# Altium schematic sheet FPGA.SchDoc
size A3; DocumentNumber: 6; SheetNumber: 6; SheetTotal: 8
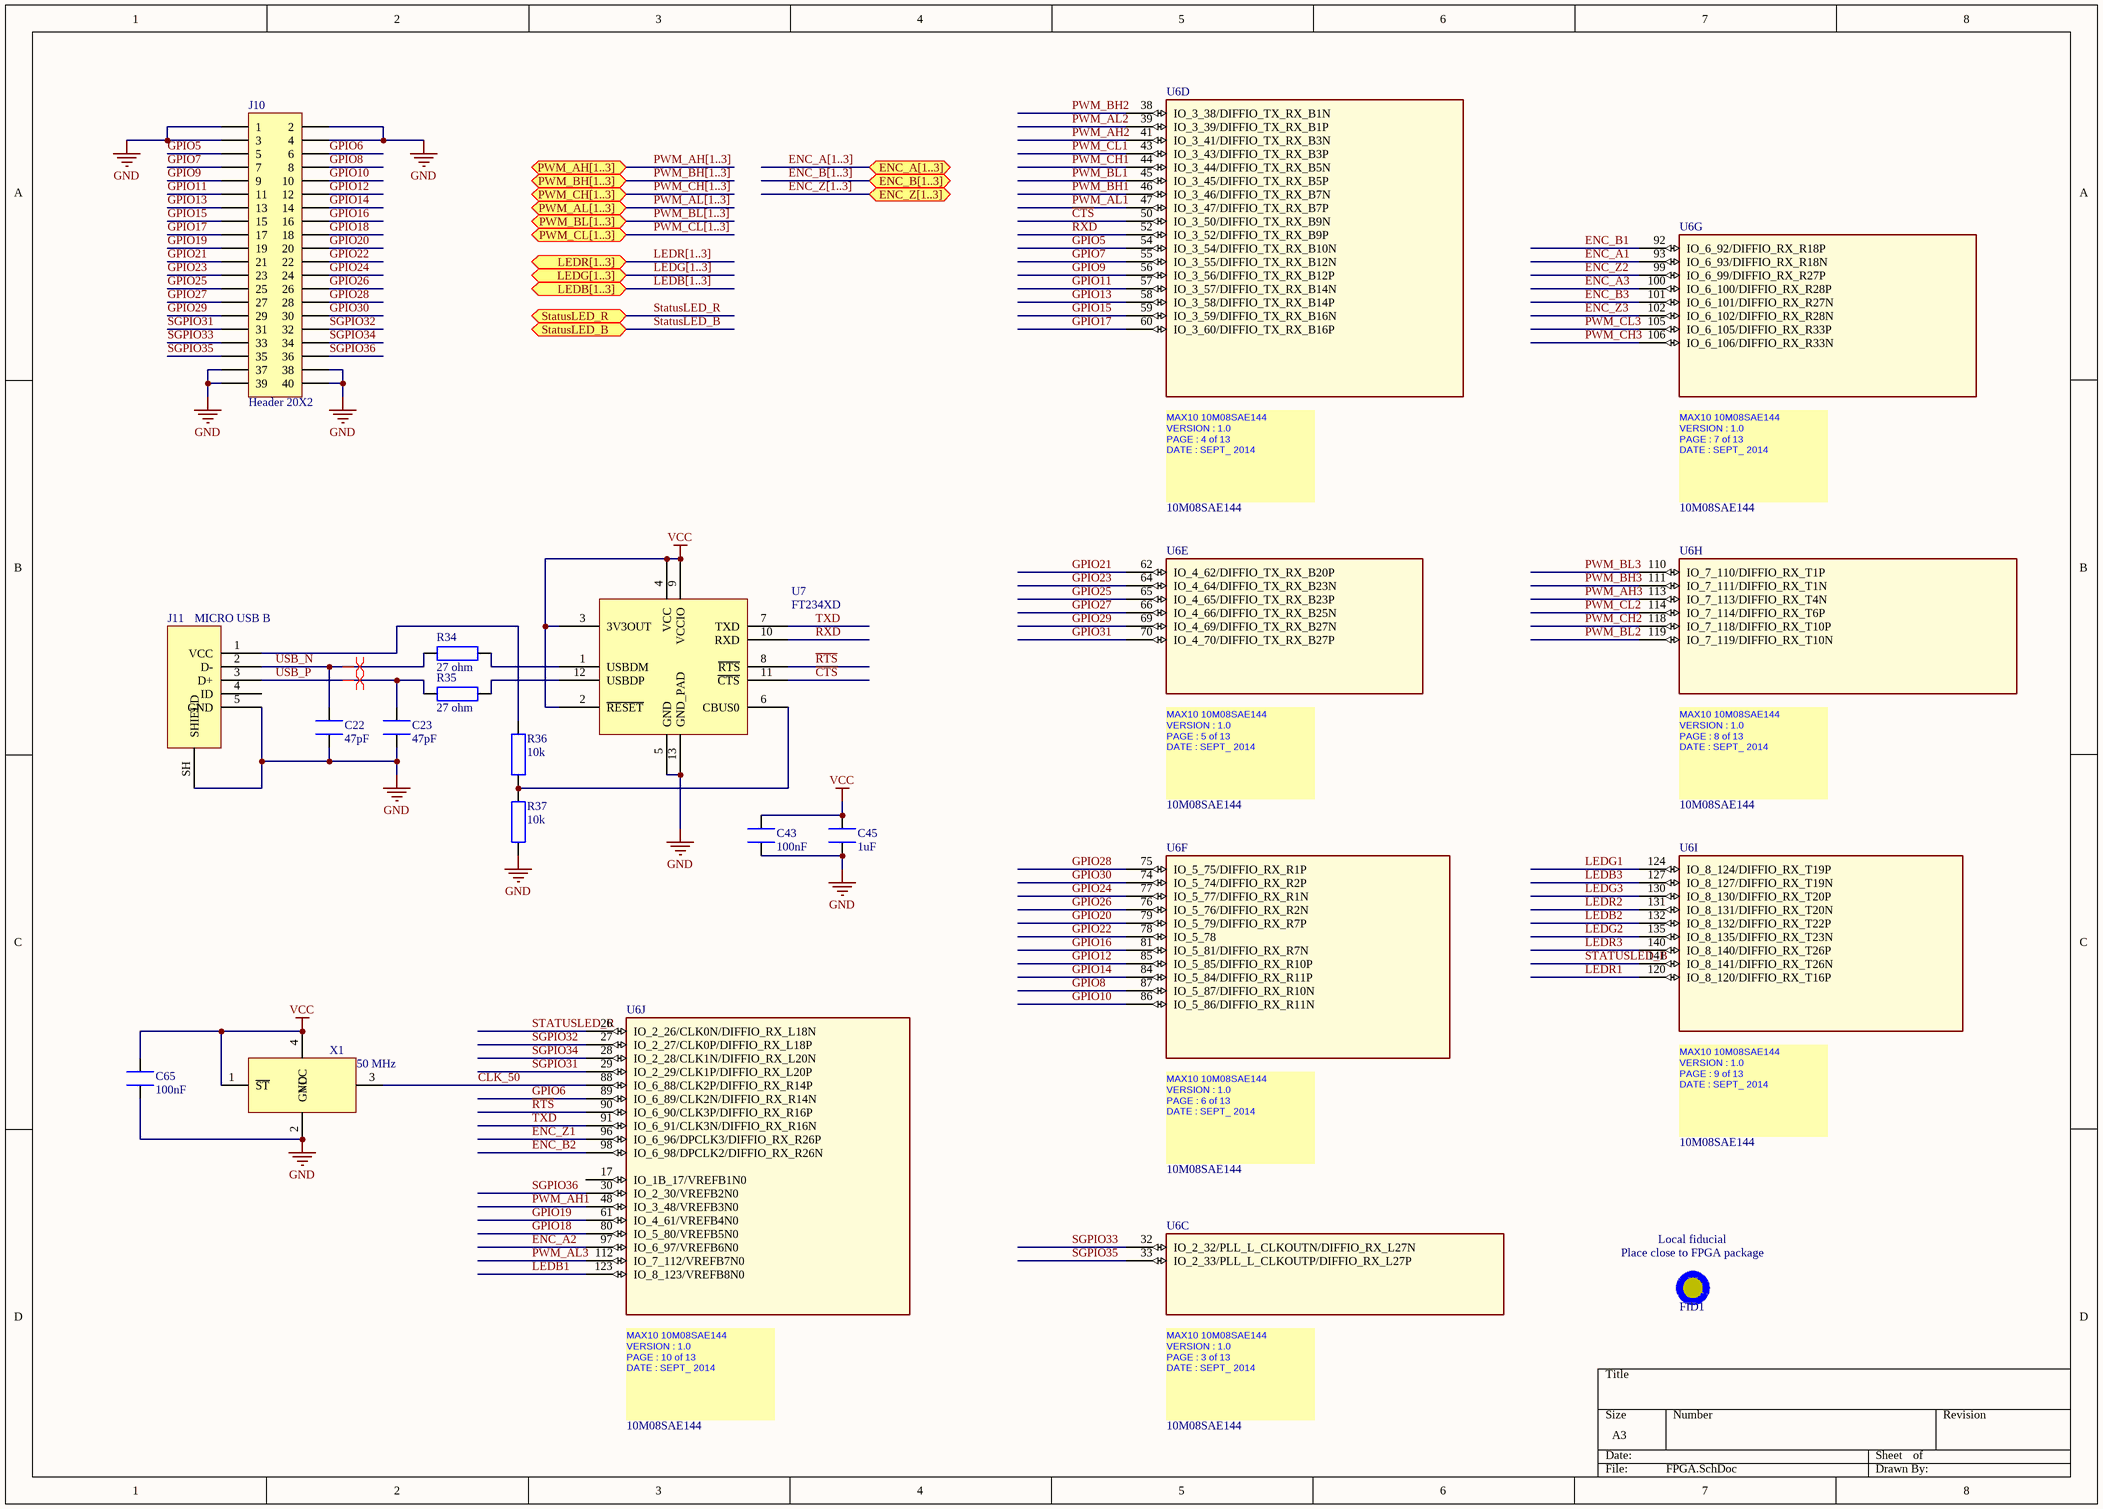
[diagram p0: FPGA.SchDoc]

## Parts
C22  value 47pF  [1608[0603]]  (hidden comment: MC0603N470J500CT)
C23  value 47pF  [1608[0603]]  (hidden comment: MC0603N470J500CT)
C43  value 100nF  [1608[0603]]  (hidden comment: MC0603B104K160CT)
C45  value 1uF  [1608[0603]]  (hidden comment: MC0603X105K160)
C65  value 100nF  [1608[0603]]  (hidden comment: MC0603B104K160CT)
FID1  FIDUCIAL  [FIDUCIAL]  (value not drawn)
J10  Header 20X2  [HDR2X20]
J11  MICRO USB B  [USB_0103594-0001LF]
R34  value 27 ohm  [RESC1608X55N]  (hidden comment: MCWR06X27R0FTL)
R35  value 27 ohm  [RESC1608X55N]  (hidden comment: MCWR06X27R0FTL)
R36  value 10k  [RESC1608X06L]  (hidden comment: MCMR06X1002FTL)
R37  value 10k  [RESC1608X06L]  (hidden comment: MCMR06X1002FTL)
U6  10M08SAE144  [SQFP50P2200X2200X165_HS-145N]  (parts C,D,E,F,G,H,I,J of 13)
U7  FT234XD  [SON45P300X90_HS-13N]
X1  value 50 MHz  [SPXO SG-210STF]  (hidden comment: X1G0041710047)

## Ports
ENC_A[1..3], ENC_B[1..3], ENC_Z[1..3], LEDB[1..3], LEDG[1..3], LEDR[1..3], PWM_AH[1..3], PWM_AL[1..3], PWM_BH[1..3], PWM_BL[1..3], PWM_CH[1..3], PWM_CL[1..3], StatusLED_B, StatusLED_R

## Nets
GND: C22.1 C23.1 C43.1 C45.1 C65.1 J10.1 J10.2 J10.3 J10.4 J10.37 J10.38 J10.39 J10.40 J11.5(GND) J11.SH(SHIELD) R37.1 U7.5(GND) U7.13(GND_PAD) X1.2(GND)
VCC: C43.2 C45.2 C65.2 U7.2(~{RESET}) U7.3(3V3OUT) U7.4(VCC) U7.9(VCCIO) X1.1(~{ST}) X1.4(VCC)
~{CTS}: U6.50(IO_3_50/DIFFIO_TX_RX_B9N) U7.11(~{CTS})
~{RTS}: U6.90(IO_6_90/CLK3P/DIFFIO_RX_R16P) U7.8(~{RTS})
CLK_50: U6.88(IO_6_88/CLK2P/DIFFIO_RX_R14P) X1.3(CLKout)
ENC_A1: U6.93(IO_6_93/DIFFIO_RX_R18N)
ENC_A2: U6.97(IO_6_97/VREFB6N0)
ENC_A3: U6.100(IO_6_100/DIFFIO_RX_R28P)
ENC_B1: U6.92(IO_6_92/DIFFIO_RX_R18P)
ENC_B2: U6.98(IO_6_98/DPCLK2/DIFFIO_RX_R26N)
ENC_B3: U6.101(IO_6_101/DIFFIO_RX_R27N)
ENC_Z1: U6.96(IO_6_96/DPCLK3/DIFFIO_RX_R26P)
ENC_Z2: U6.99(IO_6_99/DIFFIO_RX_R27P)
ENC_Z3: U6.102(IO_6_102/DIFFIO_RX_R28N)
GPIO5: J10.5 U6.54(IO_3_54/DIFFIO_TX_RX_B10N)
GPIO6: J10.6 U6.89(IO_6_89/CLK2N/DIFFIO_RX_R14N)
GPIO7: J10.7 U6.55(IO_3_55/DIFFIO_TX_RX_B12N)
GPIO8: J10.8 U6.87(IO_5_87/DIFFIO_RX_R10N)
GPIO9: J10.9 U6.56(IO_3_56/DIFFIO_TX_RX_B12P)
GPIO10: J10.10 U6.86(IO_5_86/DIFFIO_RX_R11N)
GPIO11: J10.11 U6.57(IO_3_57/DIFFIO_TX_RX_B14N)
GPIO12: J10.12 U6.85(IO_5_85/DIFFIO_RX_R10P)
GPIO13: J10.13 U6.58(IO_3_58/DIFFIO_TX_RX_B14P)
GPIO14: J10.14 U6.84(IO_5_84/DIFFIO_RX_R11P)
GPIO15: J10.15 U6.59(IO_3_59/DIFFIO_TX_RX_B16N)
GPIO16: J10.16 U6.81(IO_5_81/DIFFIO_RX_R7N)
GPIO17: J10.17 U6.60(IO_3_60/DIFFIO_TX_RX_B16P)
GPIO18: J10.18 U6.80(IO_5_80/VREFB5N0)
GPIO19: J10.19 U6.61(IO_4_61/VREFB4N0)
GPIO20: J10.20 U6.79(IO_5_79/DIFFIO_RX_R7P)
GPIO21: J10.21 U6.62(IO_4_62/DIFFIO_TX_RX_B20P)
GPIO22: J10.22 U6.78(IO_5_78)
GPIO23: J10.23 U6.64(IO_4_64/DIFFIO_TX_RX_B23N)
GPIO24: J10.24 U6.77(IO_5_77/DIFFIO_RX_R1N)
GPIO25: J10.25 U6.65(IO_4_65/DIFFIO_TX_RX_B23P)
GPIO26: J10.26 U6.76(IO_5_76/DIFFIO_RX_R2N)
GPIO27: J10.27 U6.66(IO_4_66/DIFFIO_TX_RX_B25N)
GPIO28: J10.28 U6.75(IO_5_75/DIFFIO_RX_R1P)
GPIO29: J10.29 U6.69(IO_4_69/DIFFIO_TX_RX_B27N)
GPIO30: J10.30 U6.74(IO_5_74/DIFFIO_RX_R2P)
GPIO31: U6.70(IO_4_70/DIFFIO_TX_RX_B27P)
LEDB1: U6.123(IO_8_123/VREFB8N0)
LEDB2: U6.132(IO_8_132/DIFFIO_RX_T22P)
LEDB3: U6.127(IO_8_127/DIFFIO_RX_T19N)
LEDG1: U6.124(IO_8_124/DIFFIO_RX_T19P)
LEDG2: U6.135(IO_8_135/DIFFIO_RX_T23N)
LEDG3: U6.130(IO_8_130/DIFFIO_RX_T20P)
LEDR1: U6.120(IO_8_120/DIFFIO_RX_T16P)
LEDR2: U6.131(IO_8_131/DIFFIO_RX_T20N)
LEDR3: U6.140(IO_8_140/DIFFIO_RX_T26P)
PWM_AH1: U6.48(IO_3_48/VREFB3N0)
PWM_AH2: U6.41(IO_3_41/DIFFIO_TX_RX_B3N)
PWM_AH3: U6.113(IO_7_113/DIFFIO_RX_T4N)
PWM_AL1: U6.47(IO_3_47/DIFFIO_TX_RX_B7P)
PWM_AL2: U6.39(IO_3_39/DIFFIO_TX_RX_B1P)
PWM_AL3: U6.112(IO_7_112/VREFB7N0)
PWM_BH1: U6.46(IO_3_46/DIFFIO_TX_RX_B7N)
PWM_BH2: U6.38(IO_3_38/DIFFIO_TX_RX_B1N)
PWM_BH3: U6.111(IO_7_111/DIFFIO_RX_T1N)
PWM_BL1: U6.45(IO_3_45/DIFFIO_TX_RX_B5P)
PWM_BL2: U6.119(IO_7_119/DIFFIO_RX_T10N)
PWM_BL3: U6.110(IO_7_110/DIFFIO_RX_T1P)
PWM_CH1: U6.44(IO_3_44/DIFFIO_TX_RX_B5N)
PWM_CH2: U6.118(IO_7_118/DIFFIO_RX_T10P)
PWM_CH3: U6.106(IO_6_106/DIFFIO_RX_R33N)
PWM_CL1: U6.43(IO_3_43/DIFFIO_TX_RX_B3P)
PWM_CL2: U6.114(IO_7_114/DIFFIO_RX_T6P)
PWM_CL3: U6.105(IO_6_105/DIFFIO_RX_R33P)
RXD: U6.52(IO_3_52/DIFFIO_TX_RX_B9P) U7.10(RXD)
SGPIO31: J10.31 U6.29(IO_2_29/CLK1P/DIFFIO_RX_L20P)
SGPIO32: J10.32 U6.27(IO_2_27/CLK0P/DIFFIO_RX_L18P)
SGPIO33: J10.33 U6.32(IO_2_32/PLL_L_CLKOUTN/DIFFIO_RX_L27N)
SGPIO34: J10.34 U6.28(IO_2_28/CLK1N/DIFFIO_RX_L20N)
SGPIO35: J10.35 U6.33(IO_2_33/PLL_L_CLKOUTP/DIFFIO_RX_L27P)
SGPIO36: J10.36 U6.30(IO_2_30/VREFB2N0)
StatusLED_B: U6.141(IO_8_141/DIFFIO_RX_T26N) ; port StatusLED_B
StatusLED_R: U6.26(IO_2_26/CLK0N/DIFFIO_RX_L18N) ; port StatusLED_R
TXD: U6.91(IO_6_91/CLK3N/DIFFIO_RX_R16N) U7.7(TXD)
USB_N: C22.2 J11.2(D-) R34.2
USB_P: C23.2 J11.3(D+) R35.2
NetJ11_1: J11.1(VCC) R36.2
NetR34_1: R34.1 U7.1(USBDM)
NetR35_1: R35.1 U7.12(USBDP)
NetR36_1: R36.1 R37.2 U7.6(CBUS0)

Not connected (* = marked no-connect by the designer): J11 4(ID); U6 17(IO_1B_17/VREFB1N0)

## Buses and harness runs
bus ENC_A[1..3] = port ENC_A[1..3]
bus ENC_B[1..3] = port ENC_B[1..3]
bus ENC_Z[1..3] = port ENC_Z[1..3]
bus LEDB[1..3] = port LEDB[1..3]
bus LEDG[1..3] = port LEDG[1..3]
bus LEDR[1..3] = port LEDR[1..3]
bus PWM_AH[1..3] = port PWM_AH[1..3]
bus PWM_AL[1..3] = port PWM_AL[1..3]
bus PWM_BH[1..3] = port PWM_BH[1..3]
bus PWM_BL[1..3] = port PWM_BL[1..3]
bus PWM_CH[1..3] = port PWM_CH[1..3]
bus PWM_CL[1..3] = port PWM_CL[1..3]

## Layout directives
differential pair: USB_N, USB_P

## Notes on the sheet
- (near FID1) Place close to FPGA package
- (near FID1) Local fiducial
- (in symbol 10M08SAE144, part C) MAX10 10M08SAE144 / VERSION : 1.0 / PAGE : 3 of 13 / DATE : SEPT_ 2014 /
- (in symbol 10M08SAE144, part D) MAX10 10M08SAE144 / VERSION : 1.0 / PAGE : 4 of 13 / DATE : SEPT_ 2014 /
- (in symbol 10M08SAE144, part E) MAX10 10M08SAE144 / VERSION : 1.0 / PAGE : 5 of 13 / DATE : SEPT_ 2014 /
- (in symbol 10M08SAE144, part F) MAX10 10M08SAE144 / VERSION : 1.0 / PAGE : 6 of 13 / DATE : SEPT_ 2014 /
- (in symbol 10M08SAE144, part G) MAX10 10M08SAE144 / VERSION : 1.0 / PAGE : 7 of 13 / DATE : SEPT_ 2014 /
- (in symbol 10M08SAE144, part H) MAX10 10M08SAE144 / VERSION : 1.0 / PAGE : 8 of 13 / DATE : SEPT_ 2014 /
- (in symbol 10M08SAE144, part I) MAX10 10M08SAE144 / VERSION : 1.0 / PAGE : 9 of 13 / DATE : SEPT_ 2014 /
- (in symbol 10M08SAE144, part J) MAX10 10M08SAE144 / VERSION : 1.0 / PAGE : 10 of 13 / DATE : SEPT_ 2014 /

## Library data of the parts
C22 C23 = MC0603N470J500CT: CAP, MLCC, C0G/NP0, 47PF, 50V, 0603; Supplier 1: Farnell; Supplier Part Number 1: 1759062
C43 C65 = MC0603B104K160CT: CAP, MLCC, X7R, 100NF, 16V, 0603; Supplier 1: Farnell; Supplier Part Number 1: 2310628; Supplier 2: Farnell; Supplier Part Number 2: 1759016RL; Supplier 3: Farnell; Supplier Part Number 3: 1759016
C45 = MC0603X105K160: CAP, MLCC, X5R, 1UF, 16V, 0603; Supplier 1: Farnell; Supplier Part Number 1: 2310630; Supplier 2: Farnell; Supplier Part Number 2: 1759407RL; Supplier 3: Farnell; Supplier Part Number 3: 1759407
FID1 = FIDUCIAL: 1mm Fiducial with 2mm soldermask, 3mm keepout
J10 = Header 20X2: Header, 20-Pin, Dual row; LatestRevisionDate: 17-Jul-2002; LatestRevisionNote: Re-released for DXP Platform.; Publisher: Altium Limited
J11 = 10103594-0001LF: MICRO USB B, RECEPTACLE, SMT, RA, 5WAY
R34 R35 = MCWR06X27R0FTL: RES, THICK FILM, 27OHM, 1%, 0.1W; Supplier 1: Farnell; Supplier Part Number 1: 2447316
R36 R37 = MCMR06X1002FTL: Resistor, 10k, 0603; Supplier 1: Farnell; Supplier Part Number 1: 2073349; Supplier 2: Farnell; Supplier Part Number 2: 2073349RL
U6 = 10M08SAE144: SWAP_INFO: (S1+S2+S3+S4+S5+S6+S7+S8+S9+S10+S11+S12+S13); SPLIT_INST: TRUE
X1 = X1G0041710047: OSCILLATOR, SPXO, SG-210STF, 50 MHZ, SMD; Supplier 1: Farnell; Supplier Part Number 1: 2405741RL; Supplier 2: Farnell; Supplier Part Number 2: 2405741; Supplier 3: Farnell; Supplier Part Number 3: 2428451
U7 = FT234XD: Supplier 1: Farnell; Supplier Part Number 1: 2419911